# EAGLE design CHGslaBAT (EAGLE 6.1)
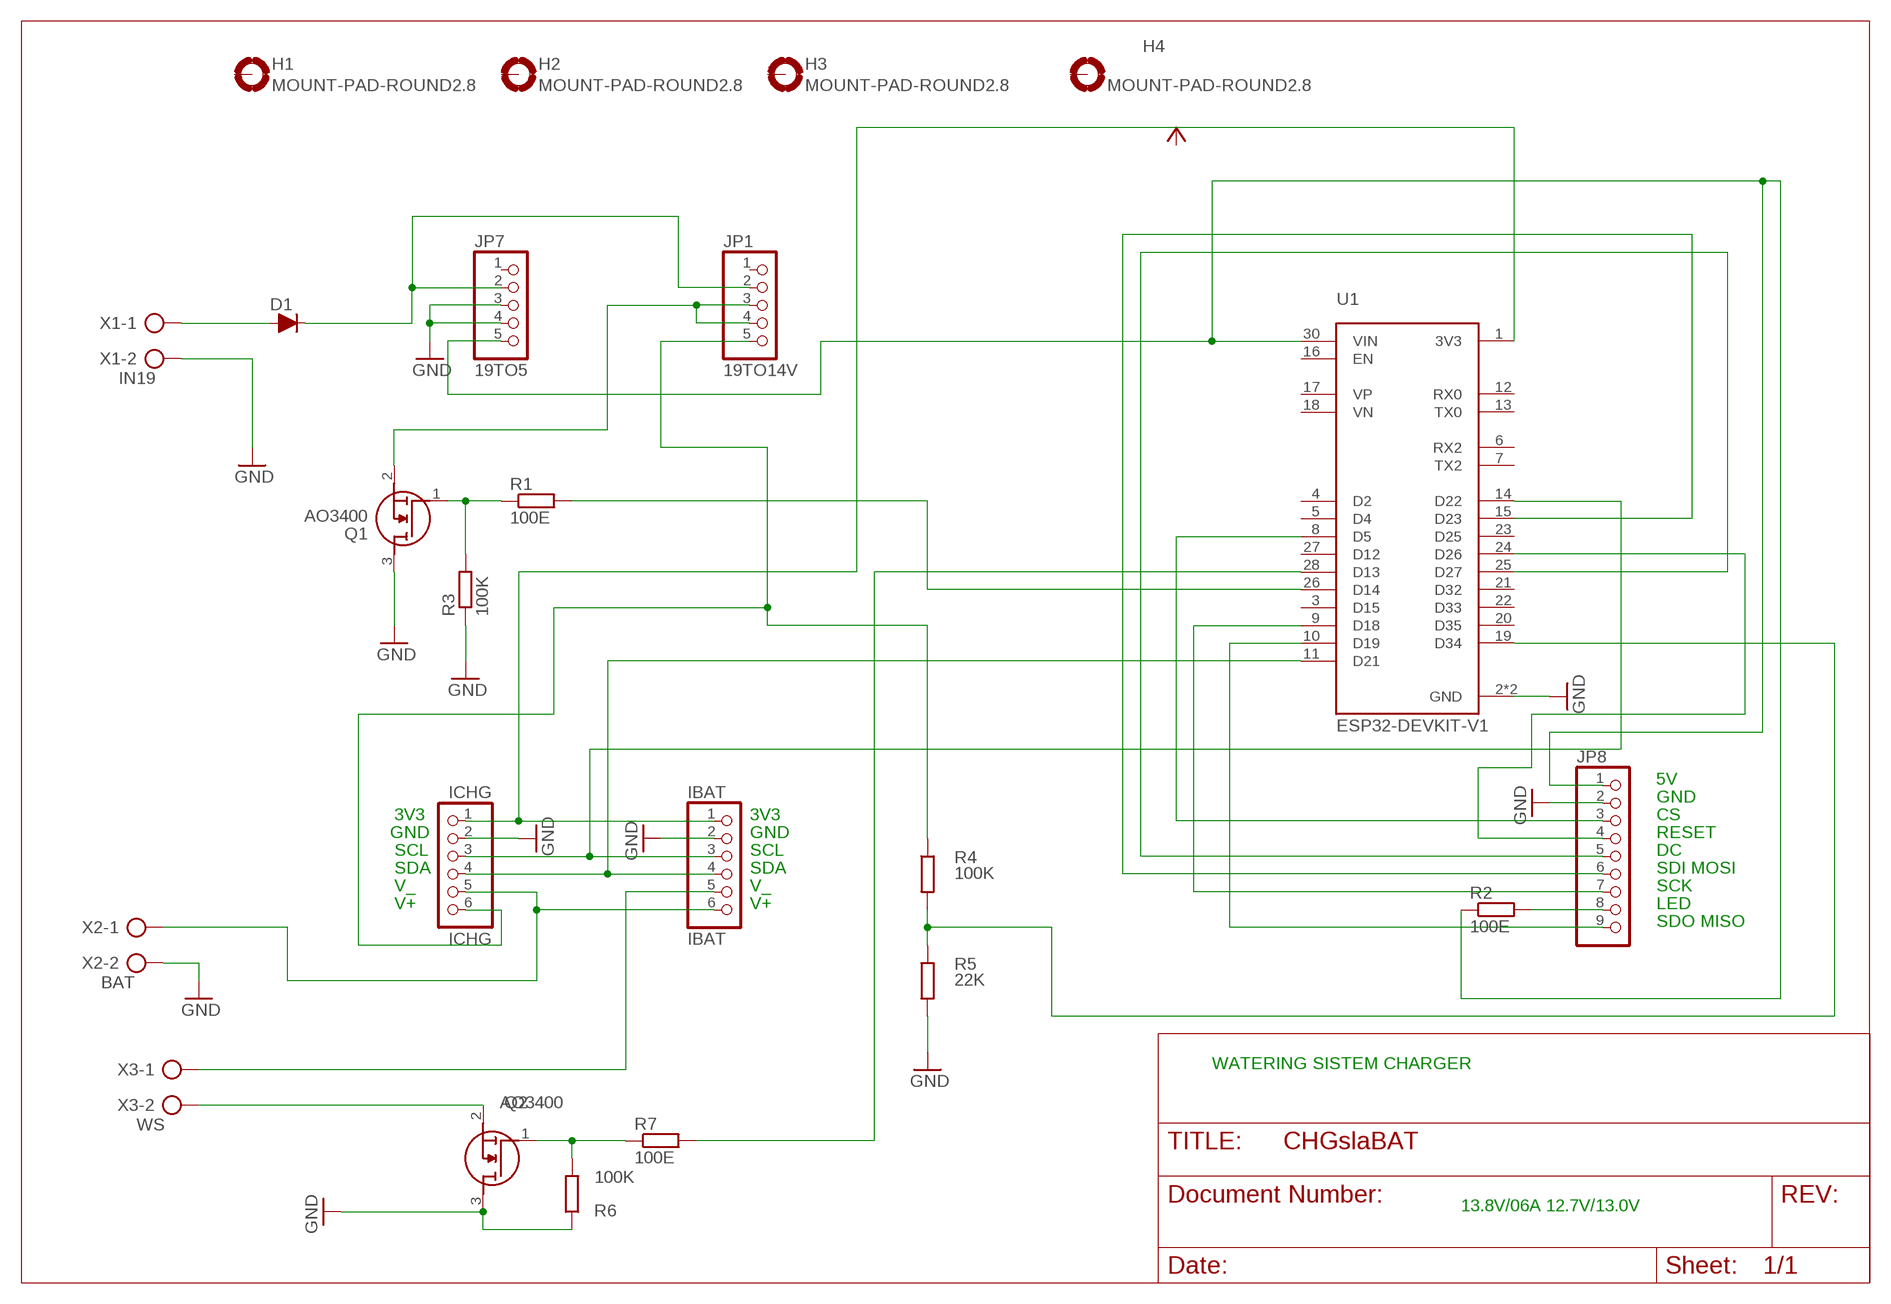
[diagram p0: schematic, sheet 1]

## Parts
D1  D-FILL-SOD-80  [SOD80]
H1  MOUNT-PAD-ROUND2.8  [2,8-PAD]
H2  MOUNT-PAD-ROUND2.8  [2,8-PAD]
H3  MOUNT-PAD-ROUND2.8  [2,8-PAD]
H4  MOUNT-PAD-ROUND2.8  [2,8-PAD]
IBAT  IBAT  PINHD-1X6  [1X06]
ICHG  ICHG  PINHD-1X6  [1X06]
JP1  19TO14V  PINHD-1X5  [1X05]
JP7  19TO5  PINHD-1X5  [1X05]
JP8  PINHD-1X9  [1X09]
Q1  AO3400  [SOT95P280X125-3N]
Q2  AO3400  [SOT95P280X125-3N]
R1  100E  R-EU_M0805  [M0805]
R2  100E  R-EU_M0805  [M0805]
R3  100K  R-EU_M0805  [M0805]
R4  100K  R-EU_M0805  [M0805]
R5  22K  R-EU_M0805  [M0805]
R6  100K  R-EU_M0805  [M0805]
R7  100E  R-EU_M0805  [M0805]
U1  ESP32-DEVKIT-V1  [MODULE_ESP32_DEVKIT_V1]
X1  IN19  AK300/2  [AK300/2]
X2  BAT  AK300/2  [AK300/2]
X3  WS  AK300/2  [AK300/2]

## Nets
GND: IBAT.2 ICHG.2 JP7.3 JP7.4 JP8.2 Q1.3(D) Q2.3(D) R3.1 R5.2 R6.1 U1.2(GND) U1.29(GND) X1.2 X2.2
N$1: D1.2(A) X1.1
N$2: D1.1(C) JP1.2 JP7.2
N$3: JP8.3 U1.8(D5)
N$4: Q2.2(S) X3.2
N$5: ICHG.6 JP1.5 R4.1
N$6: Q1.1(G) R1.1 R3.2
N$8: IBAT.1 ICHG.1 U1.1(3V3)
N$9: IBAT.6 ICHG.5 X2.1
N$10: IBAT.5 X3.1
N$11: JP8.4 U1.24(D26)
N$12: JP8.8 R2.2
N$13: JP8.5 U1.25(D27)
N$14: JP7.5 JP8.1 R2.1 U1.30(VIN)
N$15: IBAT.3 ICHG.3 U1.14(D22)
N$16: JP8.6 U1.15(D23)
N$17: JP8.7 U1.9(D18)
N$18: JP8.9 U1.10(D19)
N$19: R1.2 U1.26(D14)
N$20: IBAT.4 ICHG.4 U1.11(D21)
N$21: JP1.3 JP1.4 Q1.2(S)
N$22: R4.2 R5.1 U1.19(D34)
N$23: Q2.1(G) R6.2 R7.1
N$24: R7.2 U1.28(D13)
Unconnected: H1.B2,8(MOUNT) H2.B2,8(MOUNT) H3.B2,8(MOUNT) H4.B2,8(MOUNT) JP1.1 JP7.1 U1.3(D15) U1.4(D2) U1.5(D4) U1.6(RX2) U1.7(TX2) U1.12(RX0) U1.13(TX0) U1.16(EN) U1.17(VP) U1.18(VN) U1.20(D35) U1.21(D32) U1.22(D33) U1.23(D25) U1.27(D12)

## Notes on the sheet
- 5V
- GND
- 3V3 | 3V3 | CS
- GND | GND | RESET
- SCL | SCL | DC
- SDA | SDA | SDI MOSI
- V_ | V_ | SCK
- V+ | V+ | LED
- SDO MISO
- WATERING SISTEM CHARGER
- 13.8V/06A 12.7V/13.0V

## Library data of the parts
D1 = semicon-smd-ipc:D-FILL-: DIODE filled
H1-H4 = holes:MOUNT-PAD-ROUND: MOUNTING PAD, round
IBAT ICHG = pinhead:PINHD-1X6: PIN HEADER
JP1 JP7 = pinhead:PINHD-1X5: PIN HEADER
JP8 = pinhead:PINHD-1X9: PIN HEADER
Q1 Q2 = AO3400:AO3400: Check availability <https://pricing.snapeda.com/parts/AO3400/Microdiode%20Electronics/view-part?ref=eda>; AVAILABILITY: Not in stock; CHECK_PRICES: https://www.snapeda.com/parts/AO3400/Applied+Avionics/view-part/?ref=eda; DESCRIPTION: Trans MOSFET N-CH 30V 5.7A 3-Pin SOT-23 T/R; MF: Microdiode Electronics; MP: AO3400; PACKAGE: None; PRICE: None; SNAPEDA_LINK: https://www.snapeda.com/parts/AO3400/Applied+Avionics/view-part/?ref=snap
R1-R7 = resistor:R-EU_: RESISTOR, European symbol
U1 = ESP32-DEVKIT-V1:ESP32-DEVKIT-V1: Check availability <https://pricing.snapeda.com/parts/ESP32-DEVKIT-V1/Do%20it/view-part?ref=eda>; AVAILABILITY: Not in stock; CHECK_PRICES: https://www.snapeda.com/parts/ESP32-DEVKIT-V1/Do+it/view-part/?ref=eda; DESCRIPTION: Dual core, Wi-Fi: 2.4 GHz up to 150 Mbits/s,BLE (Bluetooth Low Energy) and legacy Bluetooth, 32 bits, Up to 240 MHz; MF: Do it; MP: ESP32-DEVKIT-V1; PACKAGE: None; PRICE: None; SNAPEDA_LINK: https://www.snapeda.com/parts/ESP32-DEVKIT-V1/Do+it/view-part/?ref=snap
X1-X3 = con-ptr500:AK300/2: CONNECTOR; OC_FARNELL: unknown; OC_NEWARK: unknown

## Board
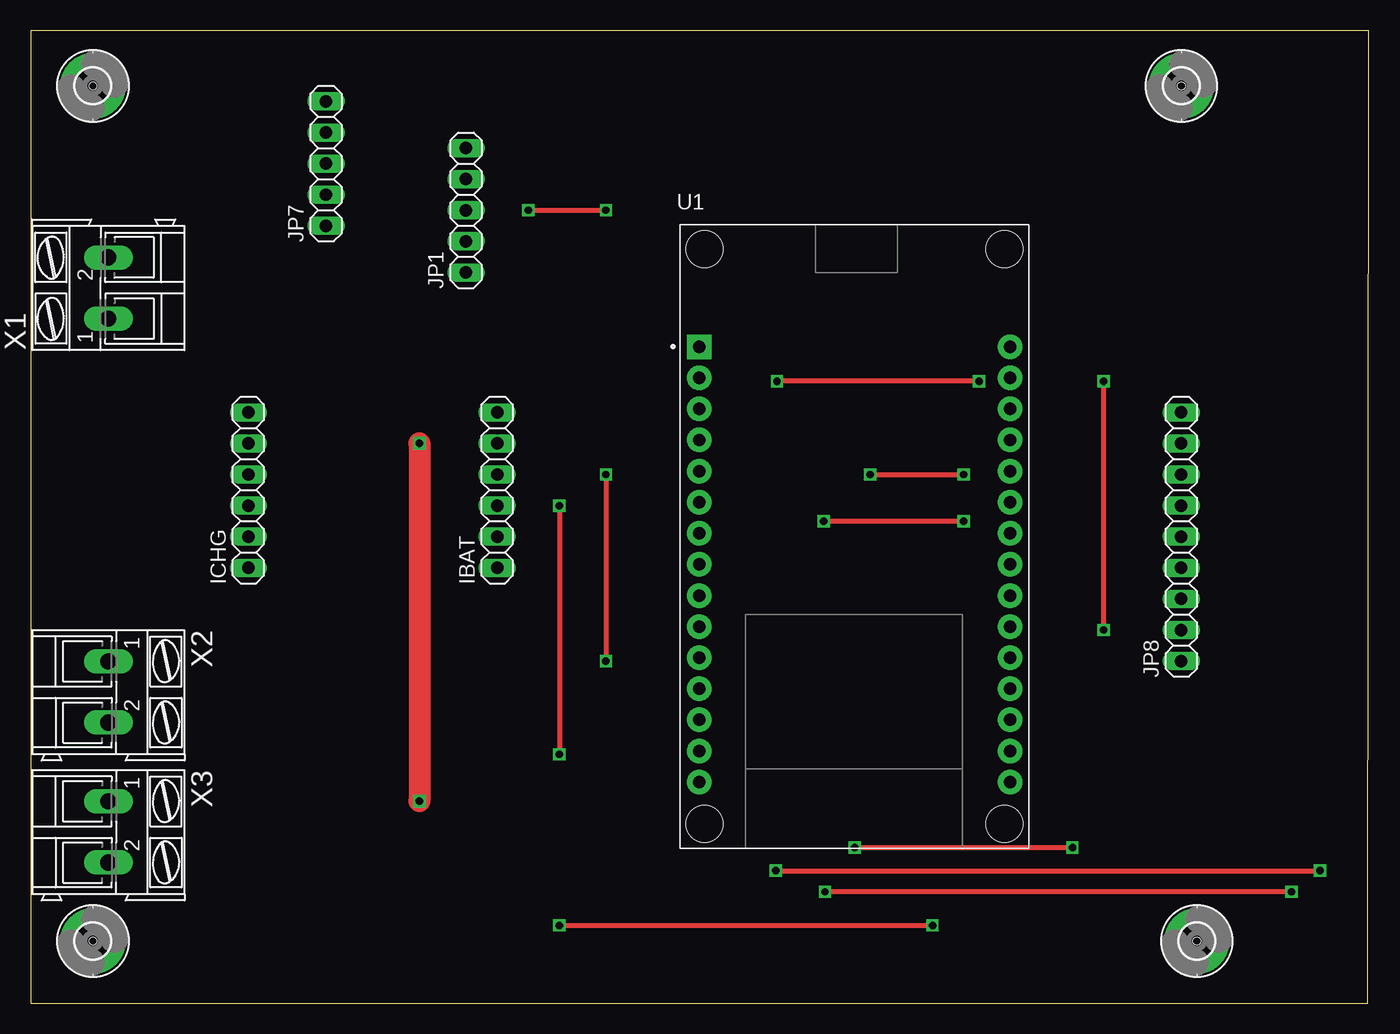
[diagram p1: board, top side]
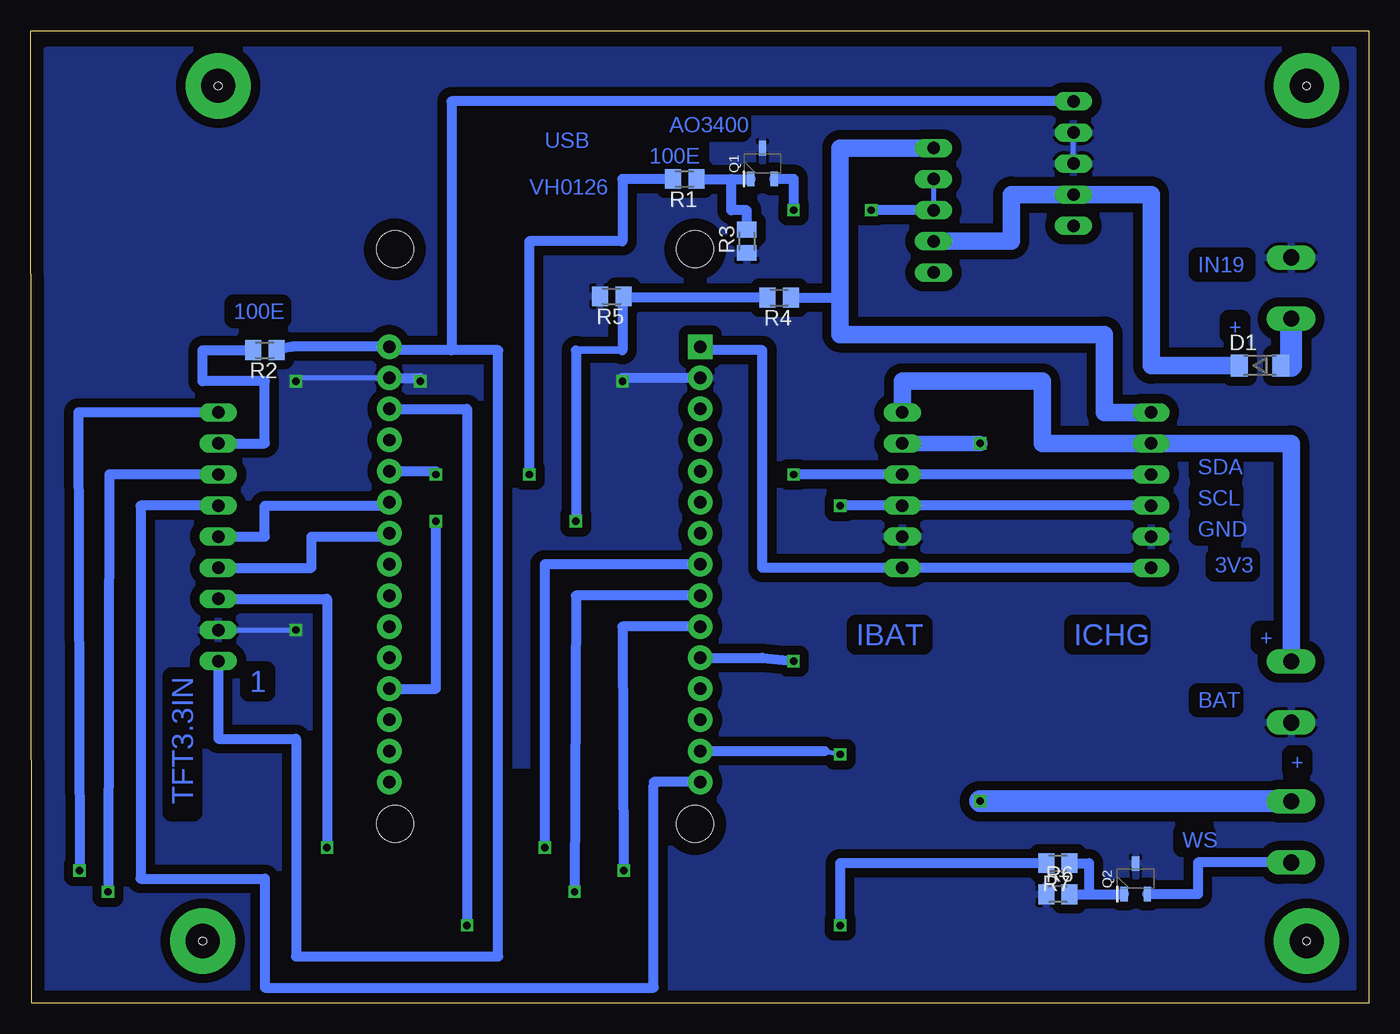
[diagram p2: board, bottom side, seen from below]

Size 109.3 x 79.44 mm. Coordinates in mm from the lower left corner, seen from the top.
Outline: 0,0 109.2,0 109.3,79.44 0,79.44 0,0
Copper layers (1*16): Top 0.035mm / dielectric 1.5mm / Bottom 0.035mm
Design rules: minimum track width 10mil, minimum drill 24mil, track to track 30mil, track to pad 35mil, pad to pad 8mil, via to via 8mil, smd to smd 8mil, copper to edge 40mil, drill to drill 8mil, minimum pad ring 10mil, minimum via ring 8mil, stop-mask expansion 4mil, vias tented up to drill 0mil, thermal gap 10mil
Holes 0.6 mm at 5.08,74.93 5.08,5.08 95.25,5.08 93.98,74.93

### Footprints (pad centres in the part's own frame; a part is rotated, then mirrored left to right if it is on the bottom)
SOD80 = smd 1.4 x 1.8: 1 -1.7,0; 2 1.7,0
2,8-PAD = drill 2.8 pad 5.334: B2,8 0,0
1X06 = drill 1.016 long: 1 -6.35,0; 2 -3.81,0; 3 -1.27,0; 4 1.27,0; 5 3.81,0; 6 6.35,0
1X05 = drill 1.016 long: 1 -5.08,0; 2 -2.54,0; 3 0,0; 4 2.54,0; 5 5.08,0
1X09 = drill 1.016 long: 1 -10.16,0; 2 -7.62,0; 3 -5.08,0; 4 -2.54,0; 5 0,0; 6 2.54,0; 7 5.08,0; 8 7.62,0; 9 10.16,0
SOT95P280X125-3N = smd 1.2 x 0.6: 1 -1.25,0.95; 2 -1.25,-0.95; 3 1.25,0
M0805 = smd 1.3 x 1.6: 1 -0.95,0; 2 0.95,0
MODULE_ESP32_DEVKIT_V1 = drill 1.02 pad 2 square: 1 -12.7,15.515 | drill 1.02 pad 2: 2 -12.7,12.975; 3 -12.7,10.435; 4 -12.7,7.895; 5 -12.7,5.355; 6 -12.7,2.815; 7 -12.7,0.275; 8 -12.7,-2.265; 9 -12.7,-4.805; 10 -12.7,-7.345; 11 -12.7,-9.885; 12 -12.7,-12.425; 13 -12.7,-14.965; 14 -12.7,-17.505; 15 -12.7,-20.045; 16 12.7,-20.045; 17 12.7,-17.505; 18 12.7,-14.965; 19 12.7,-12.425; 20 12.7,-9.885; 21 12.7,-7.345; 22 12.7,-4.805; 23 12.7,-2.265; 24 12.7,0.275; 25 12.7,2.815; 26 12.7,5.355; 27 12.7,7.895; 28 12.7,10.435; 29 12.7,12.975; 30 12.7,15.515 | hole 3: -12.28,-23.475; 12.23,-23.475; 12.23,23.475; -12.28,23.475
AK300/2 = drill 1.321 long: 1 -2.515,0; 2 2.489,0

### Placement (x,y rotation side)
D1  8.89,52.07 0 bottom
H1  5.08,5.08 0 top
H2  5.08,74.93 0 top
H3  93.98,74.93 0 top
H4  95.25,5.08 0 top
IBAT  38.1,41.91 90 top
ICHG  17.78,41.91 90 top
JP1  35.56,64.77 90 top
JP7  24.13,68.58 90 top
JP8  93.98,38.1 90 top
Q1  49.53,68.58 90 bottom
Q2  19.05,10.16 90 bottom
R1  55.88,67.31 180 bottom
R2  90.17,53.34 180 bottom
R3  50.8,62.23 90 bottom
R4  48.16,57.63 180 bottom
R5  61.84,57.74 180 bottom
R6  25.4,8.89 0 bottom
R7  25.4,11.43 180 bottom
U1  67.31,38.1 0 top
X1  6.35,58.42 90 top
X2  6.35,25.4 270 top
X3  6.35,13.97 270 top

### Tracks (layer width: path | path; a pad name or v marks a point on that pad's centre or on a via)
GND  (via drill 0.6)
  Top 0.406: v77.47,50.8 v60.96,50.8 | v87.63,50.8 v87.63,30.48
  Bottom 0.254: JP7.4 | ICHG.2
  Bottom 0.406: 60.96,51.08 v60.96,50.8 | 77.47,51.08 v77.47,50.8 | U1.29 87.63,51.08 v87.63,50.8 | JP8.2 v87.63,30.48 | JP7.3 JP7.4
  Bottom 0.813: U1.2 60.96,51.08 | U1.29 77.47,51.08
  pour Bottom: 1.27,1.27 1.27,77.82 107.95,77.82 107.95,1.27
N$1
  Bottom 0.406: D1.2 6.35,52.07
  Bottom 1.778: 6.35,52.07 X1.1
N$2
  Bottom 1.422: JP1.2 29.21,62.23 29.21,66.04 JP7.2 17.78,66.04 17.78,52.07 D1.1
N$3  (via drill 0.6)
  Top 0.406: v85.09,12.7 v67.31,12.7
  Bottom 0.813: JP8.3 85.09,33.02 v85.09,12.7 | U1.8 67.31,35.84 v67.31,12.7
N$4
  Bottom 0.406: 18.1,8.89 Q2.2
  Bottom 0.813: X3.2 13.97,11.48 13.97,8.89 18.1,8.89
N$5
  Bottom 0.406: 43.18,57.63 43.18,57.15
  Bottom 0.813: R4.1 43.18,57.63
  Bottom 1.422: JP1.5 43.18,69.85 43.18,57.15 43.18,54.61 21.59,54.61 21.59,48.26 ICHG.6
N$6
  Bottom 0.406: 50.48,67.31 Q1.1
  Bottom 0.813: R1.1 52.07,67.31 | 52.07,67.31 50.48,67.31 | R3.2 50.8,64.77 52.07,64.77 52.07,67.31
N$8
  Bottom 0.406: 54.61,53.34 U1.1
  Bottom 0.813: ICHG.1 IBAT.1 49.53,35.56 49.53,53.34 54.61,53.34
N$9
  Bottom 1.422: X2.1 6.35,45.72 ICHG.5 26.67,45.72 26.67,50.8 38.1,50.8 IBAT.6
N$10  (via drill 0.6)
  Top 1.778: v31.75,45.72 v31.75,16.51
  Bottom 0.406: 31.75,16.48 v31.75,16.51
  Bottom 1.27: IBAT.5 v31.75,45.72
  Bottom 1.778: X3.1 31.75,16.48
N$11
  Bottom 0.406: 80.01,38.1 U1.24
  Bottom 0.813: JP8.4 86.36,35.56 86.36,38.1 80.01,38.1
N$12
  Bottom 0.813: JP8.8 90.17,45.72 90.17,50.8 95.25,50.8 95.25,53.34 R2.2
N$13
  Bottom 0.406: U1.25 80.01,40.64
  Bottom 0.813: JP8.5 90.17,38.1 90.17,40.64 80.01,40.64
N$14
  Bottom 0.254: 80.01,53.34 U1.30
  Bottom 0.813: JP7.5 74.93,73.66 74.93,53.34 | 74.93,53.34 80.01,53.34 | U1.30 87.95,53.62 R2.1 | JP8.1 93.98,21.59 87.63,21.59 87.63,3.81 71.12,3.81 71.12,53.34 74.93,53.34
N$15  (via drill 0.6)
  Top 0.406: v43.18,40.64 v43.18,20.32
  Bottom 0.406: 44.45,20.59 v43.18,20.32
  Bottom 0.813: ICHG.3 IBAT.3 v43.18,40.64 | U1.14 44.45,20.59
N$16
  Bottom 0.406: 58.42,18.05 58.42,17.78
  Bottom 0.813: JP8.6 100.33,40.64 100.33,10.16 90.17,10.16 90.17,1.27 58.42,1.27 58.42,17.78 | U1.15 58.42,18.05
N$17  (via drill 0.6)
  Top 0.406: v102.97,9.09 v64.87,9.09
  Bottom 0.813: U1.9 64.77,33.3 v64.87,9.09 | JP8.7 102.87,43.18 v102.97,9.09
N$18  (via drill 0.6)
  Top 0.406: v60.86,10.82 v105.31,10.82
  Bottom 0.813: U1.10 60.96,30.76 v60.86,10.82 | JP8.9 105.41,48.26 v105.31,10.82
N$19  (via drill 0.6)
  Top 0.406: v68.58,43.18 v76.2,43.18
  Bottom 0.406: 76.2,43.45 v76.2,43.18
  Bottom 0.813: R1.2 60.96,67.31 60.96,62.23 68.58,62.23 v68.58,43.18 | U1.26 76.2,43.45
N$20  (via drill 0.6)
  Top 0.406: v46.99,43.18 v46.99,27.94
  Bottom 0.813: ICHG.4 IBAT.4 v46.99,43.18 | U1.11 49.53,28.21 v46.99,27.94
N$21  (via drill 0.6)
  Top 0.406: v40.64,64.77 v46.99,64.77
  Bottom 0.406: JP1.4 JP1.3
  Bottom 0.813: Q1.2 46.99,67.33 v46.99,64.77 | JP1.3 v40.64,64.77
N$22  (via drill 0.6)
  Top 0.406: v64.77,39.37 v76.2,39.37
  Bottom 0.254: 60.96,57.15 R5.1
  Bottom 0.61: 60.96,53.34 64.77,53.34
  Bottom 0.813: R4.2 60.96,57.63 60.96,57.15 60.96,53.34 | 64.77,53.34 v64.77,39.37 | U1.19 76.2,25.67 v76.2,39.37
N$23
  Bottom 0.406: 20,8.89 Q2.1
  Bottom 0.813: R6.2 22.86,8.89 | 22.86,8.89 20,8.89 | R7.1 22.86,11.43 22.86,8.89
N$24  (via drill 0.6)
  Top 0.406: v43.18,6.35 v73.66,6.35
  Bottom 0.813: U1.28 73.66,48.54 v73.66,6.35 | R7.2 43.18,11.43 v43.18,6.35

### Text on the board
Bottom: AO3400 | 100E | USB | VH0126 | IN19 | 100E | + | SDA | SCL | GND | 3V3 | + | ICHG | IBAT | TFT3.3IN | 1 | BAT | + | WS